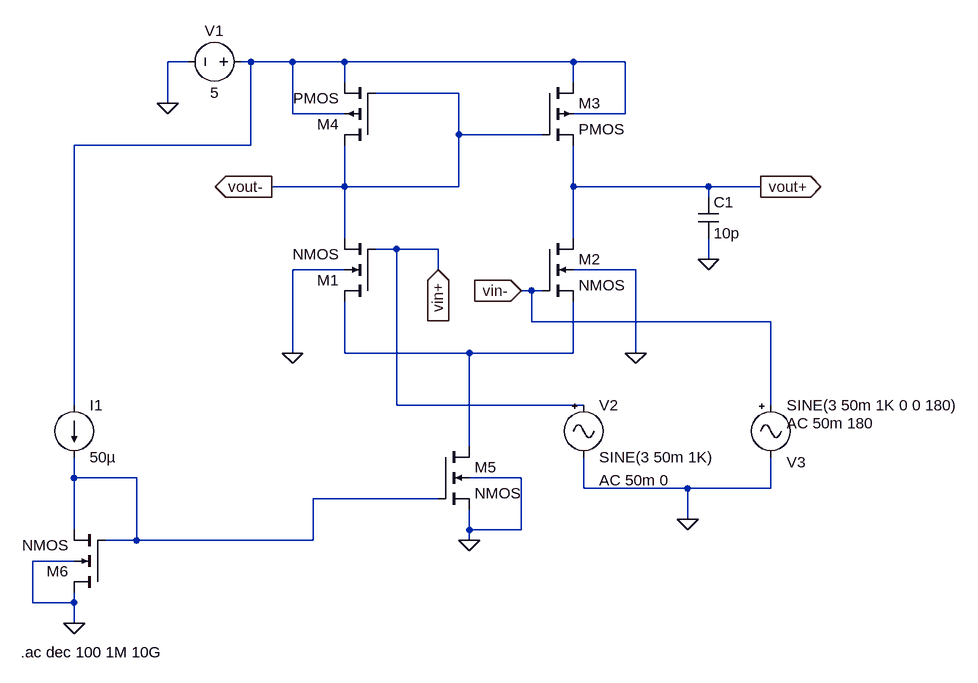
[diagram p0: schematic Differential Amp.asc]
Differential Amp.asc, the LTspice schematic file:
Version 4
SHEET 1 988 860
WIRE -240 -64 -272 -64
WIRE -144 -64 -160 -64
WIRE -80 -64 -144 -64
WIRE 0 -64 -80 -64
WIRE 352 -64 0 -64
WIRE 432 -64 352 -64
WIRE 0 -32 0 -64
WIRE 352 -32 352 -64
WIRE 176 -16 48 -16
WIRE -272 0 -272 -64
WIRE -80 16 -80 -64
WIRE 0 16 -80 16
WIRE 432 16 432 -64
WIRE 432 16 352 16
WIRE 176 48 176 -16
WIRE 304 48 176 48
WIRE -144 64 -144 -64
WIRE -144 64 -416 64
WIRE 0 128 0 64
WIRE 0 128 -112 128
WIRE 176 128 176 48
WIRE 176 128 0 128
WIRE 352 128 352 64
WIRE 560 128 352 128
WIRE 640 128 560 128
WIRE 560 144 560 128
WIRE 0 208 0 128
WIRE 352 208 352 128
WIRE 80 224 48 224
WIRE 144 224 80 224
WIRE 560 240 560 208
WIRE 0 256 -80 256
WIRE 144 256 144 224
WIRE 448 256 352 256
WIRE 288 288 272 288
WIRE 304 288 288 288
WIRE 288 336 288 288
WIRE 656 336 288 336
WIRE -80 384 -80 256
WIRE 0 384 0 304
WIRE 192 384 0 384
WIRE 352 384 352 304
WIRE 352 384 192 384
WIRE 448 384 448 256
WIRE -416 464 -416 64
WIRE 80 464 80 224
WIRE 368 464 80 464
WIRE 656 464 656 336
WIRE 192 528 192 384
WIRE -416 576 -416 544
WIRE -320 576 -416 576
WIRE 272 576 192 576
WIRE 368 592 368 544
WIRE 528 592 368 592
WIRE 656 592 656 544
WIRE 656 592 528 592
WIRE 144 608 -48 608
WIRE 528 640 528 592
WIRE -416 656 -416 576
WIRE 192 656 192 624
WIRE 272 656 272 576
WIRE 272 656 192 656
WIRE -320 672 -320 576
WIRE -320 672 -368 672
WIRE -48 672 -48 608
WIRE -48 672 -320 672
WIRE 192 672 192 656
WIRE -416 704 -480 704
WIRE -480 768 -480 704
WIRE -416 768 -416 752
WIRE -416 768 -480 768
WIRE -416 800 -416 768
FLAG 192 672 0
FLAG -416 800 0
FLAG 560 240 0
FLAG -80 384 0
FLAG 448 384 0
FLAG 640 128 vout+
IOPIN 640 128 Out
FLAG 272 288 vin-
IOPIN 272 288 In
FLAG 144 256 vin+
IOPIN 144 256 In
FLAG -112 128 vout-
IOPIN -112 128 Out
FLAG -272 0 0
FLAG 528 640 0
SYMBOL nmos4 48 304 R180
SYMATTR InstName M1
SYMATTR Value2 l=1 w=7
SYMBOL nmos4 304 208 R0
SYMATTR InstName M2
SYMATTR Value2 l=1 w=7
SYMBOL pmos4 304 -32 R0
SYMATTR InstName M3
SYMATTR Value2 l=1 w=2
SYMBOL pmos4 48 64 R180
SYMATTR InstName M4
SYMATTR Value2 l=1 w=2
SYMBOL cap 544 144 R0
SYMATTR InstName C1
SYMATTR Value 10p
SYMBOL voltage -144 -64 R90
WINDOW 0 -32 56 VBottom 2
WINDOW 3 32 56 VTop 2
WINDOW 123 0 0 Left 0
WINDOW 39 0 0 Left 0
SYMATTR InstName V1
SYMATTR Value 5
SYMBOL nmos4 144 528 R0
SYMATTR InstName M5
SYMATTR Value2 l=1 w=3
SYMBOL nmos4 -368 752 R180
SYMATTR InstName M6
SYMATTR Value2 l=1 w=3
SYMBOL current -416 464 R0
WINDOW 123 0 0 Left 0
WINDOW 39 0 0 Left 0
SYMATTR InstName I1
SYMATTR Value 50µ
SYMBOL Misc\\signal 368 448 R0
WINDOW 123 24 132 Left 2
WINDOW 39 0 0 Left 0
SYMATTR Value2 AC 50m 0
SYMATTR InstName V2
SYMATTR Value SINE(3 50m 1K)
SYMBOL Misc\\signal 656 448 R0
WINDOW 0 24 104 Left 2
WINDOW 3 24 16 Left 2
WINDOW 123 24 44 Left 2
WINDOW 39 0 0 Left 0
SYMATTR InstName V3
SYMATTR Value SINE(3 50m 1K 0 0 180)
SYMATTR Value2 AC 50m 180
TEXT -498 844 Left 2 !.ac dec 100 1M 10G

The netlist it stands for:
* Differential Amp.asc
M1 N002 vin+ vout- 0 NMOS l=1 w=7
M2 vout+ vin- N002 0 NMOS l=1 w=7
M3 N001 vout- vout+ N001 PMOS l=1 w=2
M4 vout- vout- N001 N001 PMOS l=1 w=2
C1 vout+ 0 10p
V1 N001 0 5
M5 N002 N003 0 0 NMOS l=1 w=3
M6 0 N003 N003 0 NMOS l=1 w=3
I1 N001 N003 50µ
V2 vin+ 0 SINE(3 50m 1K) AC 50m 0
V3 vin- 0 SINE(3 50m 1K 0 0 180) AC 50m 180
.model NMOS NMOS
.model PMOS PMOS
.lib standard.mos
.ac dec 100 1M 10G
.backanno
.end